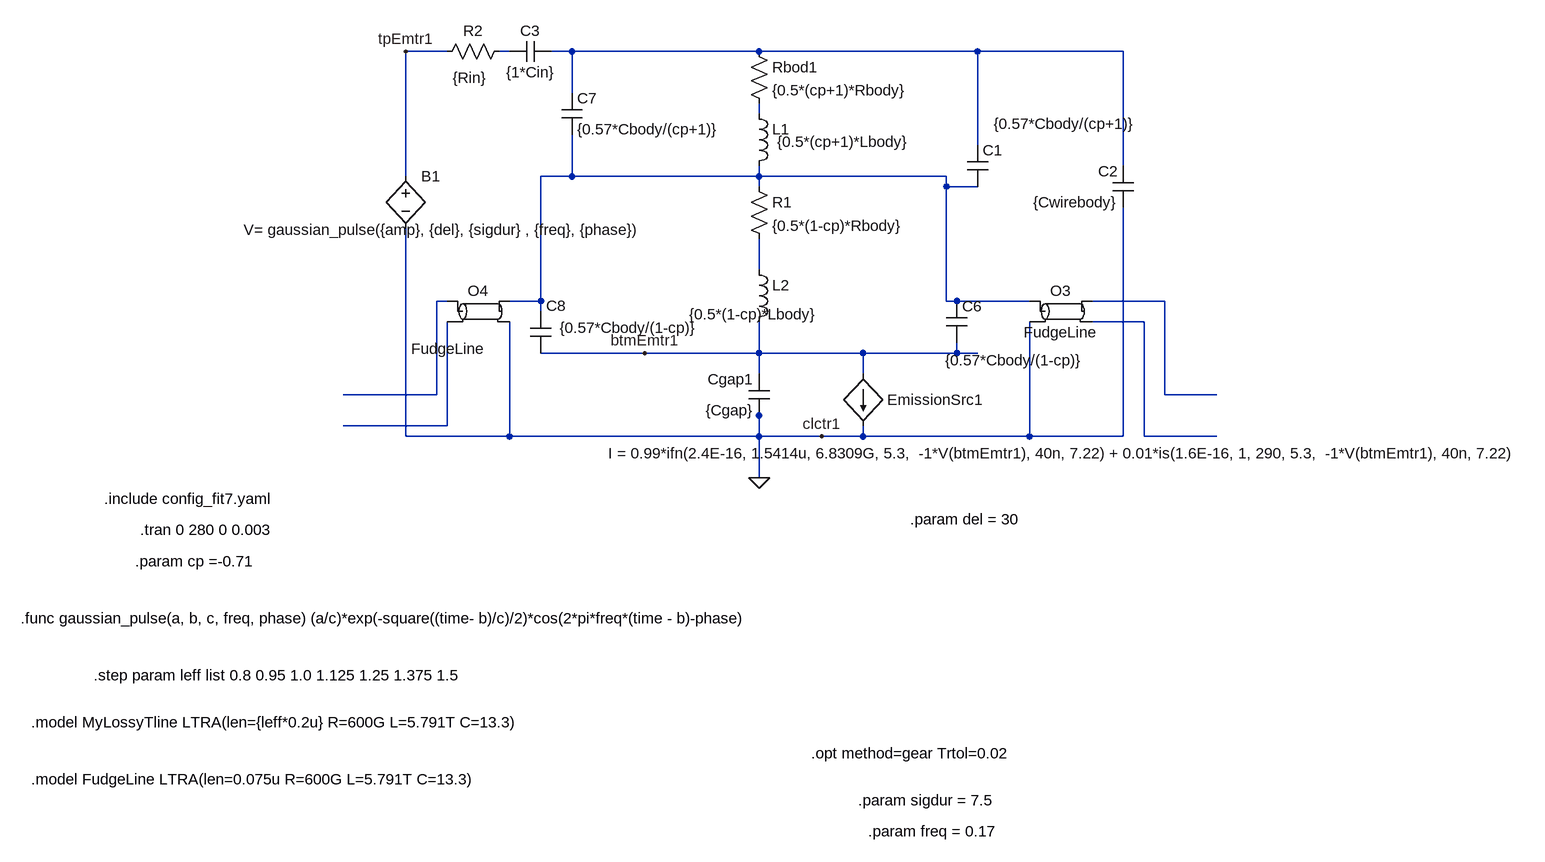
[diagram p0: schematic update_antenna_model.asc]
update_antenna_model.asc, the LTspice schematic file:
Version 4.1
SHEET 1 2240 1336
WIRE -144 -48 -208 -48
WIRE -48 -48 -64 -48
WIRE 48 -48 16 -48
WIRE 336 -48 48 -48
WIRE 672 -48 336 -48
WIRE 896 -48 672 -48
WIRE 48 16 48 -48
WIRE 336 48 336 32
WIRE 672 96 672 -48
WIRE 896 128 896 -48
WIRE -208 144 -208 -48
WIRE 48 144 48 80
WIRE 48 144 0 144
WIRE 336 144 336 128
WIRE 336 144 48 144
WIRE 624 144 336 144
WIRE 336 160 336 144
WIRE 624 160 624 144
WIRE 672 160 624 160
WIRE 336 288 336 240
WIRE -144 336 -160 336
WIRE 0 336 0 144
WIRE 0 336 -48 336
WIRE 624 336 624 160
WIRE 640 336 624 336
WIRE 752 336 640 336
WIRE 960 336 848 336
WIRE 0 352 0 336
WIRE 928 368 848 368
WIRE 160 416 0 416
WIRE 336 416 336 368
WIRE 336 416 160 416
WIRE 496 416 336 416
WIRE 640 416 640 400
WIRE 640 416 496 416
WIRE 672 416 640 416
WIRE 336 448 336 416
WIRE 496 448 496 416
WIRE -160 480 -160 336
WIRE -160 480 -304 480
WIRE 960 480 960 336
WIRE 1040 480 960 480
WIRE 336 512 336 496
WIRE -144 528 -144 368
WIRE -144 528 -304 528
WIRE -208 544 -208 224
WIRE -48 544 -48 368
WIRE -48 544 -208 544
WIRE 336 544 336 512
WIRE 336 544 -48 544
WIRE 432 544 336 544
WIRE 496 544 496 528
WIRE 496 544 432 544
WIRE 752 544 752 368
WIRE 752 544 496 544
WIRE 896 544 896 192
WIRE 896 544 752 544
WIRE 928 544 928 368
WIRE 1040 544 928 544
WIRE 336 608 336 544
FLAG 160 416 btmEmtr1
FLAG 432 544 clctr1
FLAG -208 -48 tpEmtr1
FLAG 336 608 0
SYMBOL cap 656 96 R0
WINDOW 3 41 -33 Left 2
SYMATTR Value {0.57*Cbody/(cp+1)}
SYMATTR InstName C1
SYMBOL cap 352 512 R180
WINDOW 0 24 56 Left 2
WINDOW 3 24 8 Left 2
SYMATTR InstName Cgap1
SYMATTR Value {Cgap}
SYMBOL cap 912 192 R180
WINDOW 0 24 56 Left 2
WINDOW 3 24 8 Left 2
SYMATTR InstName C2
SYMATTR Value {Cwirebody}
SYMBOL res 320 -64 R0
SYMATTR InstName Rbod1
SYMATTR Value {0.5*(cp+1)*Rbody}
SYMBOL res 320 144 R0
SYMATTR InstName R1
SYMATTR Value {0.5*(1-cp)*Rbody}
SYMBOL ind 320 32 R0
WINDOW 3 44 59 Left 2
SYMATTR Value {0.5*(cp+1)*Lbody}
SYMATTR InstName L1
SYMBOL ind 320 272 R0
WINDOW 3 -92 84 Left 2
SYMATTR Value {0.5*(1-cp)*Lbody}
SYMATTR InstName L2
SYMBOL res -48 -64 R90
WINDOW 0 0 56 VBottom 2
WINDOW 3 41 61 VTop 2
SYMATTR InstName R2
SYMATTR Value {Rin}
SYMBOL cap 16 -64 R90
WINDOW 0 0 32 VBottom 2
WINDOW 3 32 32 VTop 2
SYMATTR InstName C3
SYMATTR Value {1*Cin}
SYMBOL cap 624 336 R0
WINDOW 3 -2 91 Left 2
SYMATTR Value {0.57*Cbody/(1-cp)}
SYMATTR InstName C6
SYMBOL cap 32 16 R0
SYMATTR InstName C7
SYMATTR Value {0.57*Cbody/(cp+1)}
SYMBOL cap -16 352 R0
WINDOW 0 24 -9 Left 2
WINDOW 3 45 25 Left 2
SYMATTR InstName C8
SYMATTR Value {0.57*Cbody/(1-cp)}
SYMBOL ltline 800 352 R0
SYMATTR InstName O3
SYMATTR Value FudgeLine
SYMBOL ltline -96 352 R0
WINDOW 3 -46 42 Top 2
SYMATTR Value FudgeLine
SYMATTR InstName O4
SYMBOL bv -208 128 R0
WINDOW 3 -249 98 Left 2
SYMATTR Value V= gaussian_pulse({amp}, {del}, {sigdur} , {freq}, {phase})
SYMATTR InstName B1
SYMBOL bi 496 448 R0
WINDOW 3 -392 122 Left 2
WINDOW 0 37 40 Left 2
SYMATTR Value I = 0.99*ifn(2.4E-16, 1.5414u, 6.8309G, 5.3,  -1*V(btmEmtr1), 40n, 7.22) + 0.01*is(1.6E-16, 1, 290, 5.3,  -1*V(btmEmtr1), 40n, 7.22)
SYMATTR InstName EmissionSrc1
TEXT -672 640 Left 2 !.include config_fit7.yaml
TEXT -616 688 Left 2 !.tran 0 280 0 0.003
TEXT -624 736 Left 2 !.param cp =-0.71
TEXT -688 912 Left 2 !.step param leff list 0.8 0.95 1.0 1.125 1.25 1.375 1.5
TEXT -800 824 Left 2 !.func gaussian_pulse(a, b, c, freq, phase) (a/c)*exp(-square((time- b)/c)/2)*cos(2*pi*freq*(time - b)-phase)
TEXT 568 672 Left 2 !.param del = 30
TEXT 416 1032 Left 2 !.opt method=gear Trtol=0.02
TEXT 488 1104 Left 2 !.param sigdur = 7.5
TEXT 504 1152 Left 2 !.param freq = 0.17
TEXT -784 984 Left 2 !.model MyLossyTline LTRA(len={leff*0.2u} R=600G L=5.791T C=13.3)
TEXT -784 1072 Left 2 !.model FudgeLine LTRA(len=0.075u R=600G L=5.791T C=13.3)

The netlist it stands for:
* update_antenna_model.asc
C1 N002 N004 {0.57*Cbody/(cp+1)}
Cgap1 0 btmEmtr1 {Cgap}
C2 0 N002 {Cwirebody}
Rbod1 N002 N003 {0.5*(cp+1)*Rbody}
R1 N004 N005 {0.5*(1-cp)*Rbody}
L1 N003 N004 {0.5*(cp+1)*Lbody}
L2 N005 btmEmtr1 {0.5*(1-cp)*Lbody}
R2 N001 tpEmtr1 {Rin}
C3 N002 N001 {1*Cin}
C6 N004 btmEmtr1 {0.57*Cbody/(1-cp)}
C7 N002 N004 {0.57*Cbody/(cp+1)}
C8 N004 btmEmtr1 {0.57*Cbody/(1-cp)}
O3 N004 0 N007 N008 FudgeLine
O4 N006 N009 N004 0 FudgeLine
B1 tpEmtr1 0 V= gaussian_pulse({amp}, {del}, {sigdur} , {freq}, {phase})
B§EmissionSrc1 btmEmtr1 0 I = 0.99*ifn(2.4E-16, 1.5414u, 6.8309G, 5.3,  -1*V(btmEmtr1), 40n, 7.22) + 0.01*is(1.6E-16, 1, 290, 5.3,  -1*V(btmEmtr1), 40n, 7.22)
.include config_fit7.yaml
.tran 0 280 0 0.003
.param cp =-0.71
.step param leff list 0.8 0.95 1.0 1.125 1.25 1.375 1.5
.func gaussian_pulse(a, b, c, freq, phase) (a/c)*exp(-square((time- b)/c)/2)*cos(2*pi*freq*(time - b)-phase)
.param del = 30
.opt method=gear Trtol=0.02
.param sigdur = 7.5
.param freq = 0.17
.model MyLossyTline LTRA(len={leff*0.2u} R=600G L=5.791T C=13.3)
.model FudgeLine LTRA(len=0.075u R=600G L=5.791T C=13.3)
.backanno
.end